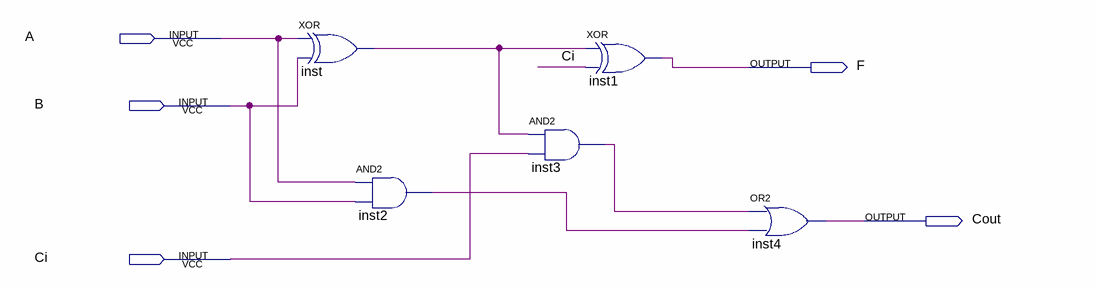
[diagram p0: schematic sheet]
// Quartus schematic ADD1.bdf as structural Verilog: 5 symbols, 5 pins
module ADD1 (
  input  A,
  input  B,
  input  Ci,
  output F,
  output Cout
);

  wire inst2_out, inst3_out, inst_out;

  xor inst (inst_out, A, B);
  and inst2 (inst2_out, A, B);
  xor inst1 (F, inst_out, Ci);
  and inst3 (inst3_out, inst_out, Ci);
  or inst4 (Cout, inst3_out, inst2_out);
endmodule
